# EAGLE design main (EAGLE 8.3.1)
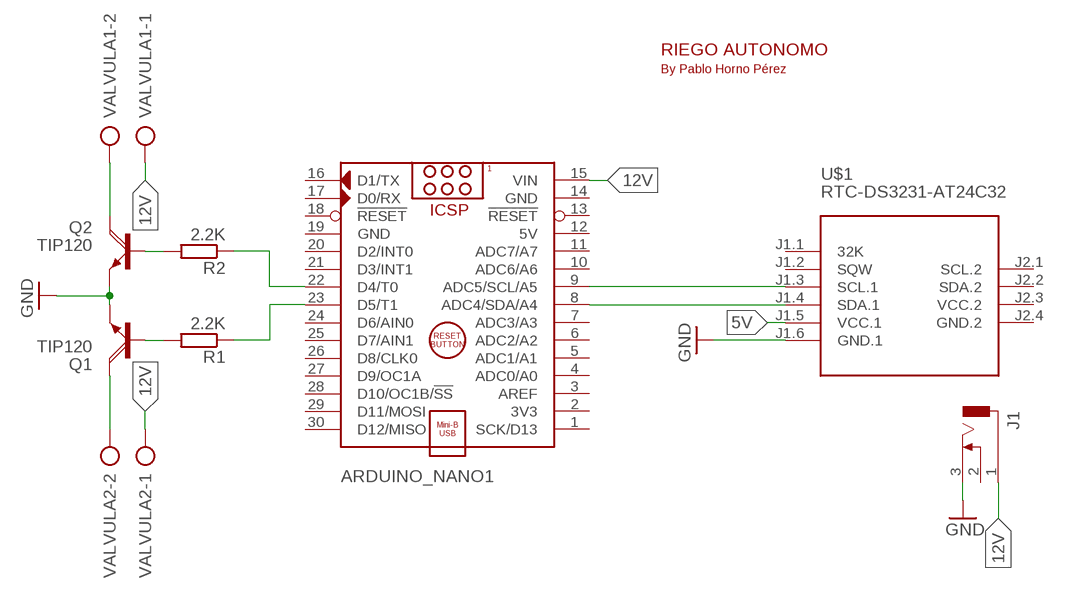
[diagram p0: schematic, sheet 1]

## Parts
ARDUINO_NANO1  ARDUINO_NANO  [ARDUINO_NANO]
J1  DCJ0303  [DCJ0303]
Q1  TIP120  [TO220AH]
Q2  TIP120  [TO220AH]
R1  2.2K  R-EU_0207/10  [0207/10]
R2  2.2K  R-EU_0207/10  [0207/10]
U$1  RTC-DS3231-AT24C32  [RTC-DS3231-AT24C32]
VALVULA1  AK500/2  [AK500/2]
VALVULA2  AK500/2  [AK500/2]

## Nets
5V: U$1.J1.5(VCC.1)
12V: ARDUINO_NANO1.15(VIN) J1.1 VALVULA1.1 VALVULA2.1
GND: J1.3 Q1.E Q2.E U$1.J1.6(GND.1)
N$1: Q2.B R2.2
N$2: Q1.B R1.2
N$3: ARDUINO_NANO1.8(ADC4/SDA/A4) U$1.J1.4(SDA.1)
N$4: ARDUINO_NANO1.9(ADC5/SCL/A5) U$1.J1.3(SCL.1)
N$5: Q1.C VALVULA2.2
N$6: Q2.C VALVULA1.2
N$7: ARDUINO_NANO1.23(D5/T1) R1.1
N$8: ARDUINO_NANO1.22(D4/T0) R2.1
Unconnected: ARDUINO_NANO1.1(SCK/D13) ARDUINO_NANO1.2(3V3) ARDUINO_NANO1.3(AREF) ARDUINO_NANO1.4(ADC0/A0) ARDUINO_NANO1.5(ADC1/A1) ARDUINO_NANO1.6(ADC2/A2) ARDUINO_NANO1.7(ADC3/A3) ARDUINO_NANO1.10(ADC6/A6) ARDUINO_NANO1.11(ADC7/A7) ARDUINO_NANO1.13(!RESET) ARDUINO_NANO1.16(D1/TX) ARDUINO_NANO1.17(D0/RX) ARDUINO_NANO1.18(!RESET) ARDUINO_NANO1.20(D2/INT0) ARDUINO_NANO1.21(D3/INT1) ARDUINO_NANO1.24(D6/AIN0) ARDUINO_NANO1.25(D7/AIN1) ARDUINO_NANO1.26(D8/CLK0) ARDUINO_NANO1.27(D9/OC1A) ARDUINO_NANO1.28(D10/OC1B/!SS) ARDUINO_NANO1.29(D11/MOSI) ARDUINO_NANO1.30(D12/MISO) J1.2 U$1.J1.1(32K) U$1.J1.2(SQW) U$1.J2.1(SCL.2) U$1.J2.2(SDA.2)

## Notes on the sheet
- RIEGO AUTONOMO
- By Pablo Horno Pérez

## Power pins joined to a net without a drawn wire
5V: ARDUINO_NANO1.12(5V)
GND: ARDUINO_NANO1.14(GND) ARDUINO_NANO1.19(GND)
GND.2: U$1.J2.4(GND.2)
VCC.2: U$1.J2.3(VCC.2)

## Library data of the parts
ARDUINO_NANO1 = ArduinoNanoV30:ARDUINO_NANO: Arduino Nano V3.0 Module Overview: The Arduino Nano is a small, complete, and breadboard-friendly board based on the ATmega328 (Arduino Nano 3.x) or ATmega168 (Arduino Nano 2.x). It has more or less the same functionality of the Arduino Duemilanove, but in a different package. It lacks only a DC power jack, and works with a Mini-B USB cable instead of a standard one. The Nano was designed and is being produced by Gravitech <http://www.gravitech.us/arna30wiatp.html>. General specifications: Item Value Microcontroller Atmel ATmega168 or ATmega328 Operating Voltage (logic level) 5 V Input Voltage (recommended) 7-12 V Input Voltage (limits) 6-20 V Digital I/O Pins 14 (of which 6 provide PWM output) Analog Input Pins 8 DC Current per I/O Pin 40 mA Flash Memory 16 KB (ATmega168) or 32 KB (ATmega328) of which 2 KB used by bootloader SRAM 1 KB (ATmega168) or 2 KB (ATmega328) EEPROM 512 bytes (ATmega168) or 1 KB (ATmega328) Clock Speed 16 MHz Dimensions (Inches) 0.73" x 1.70" Dimensions (mm) 18mm x 45mm Overall height About 9 mm (not including pins) Weigth 5 g Power: The Arduino Nano can be powered via the Mini-B USB connection, 6-20V unregulated external power supply (pin 30), or 5V regulated external power supply (pin 27). The power source is automatically selected to the highest voltage source. Memory: The ATmega168 has 16 KB of flash memory for storing code (of which 2 KB is used for the bootloader); the ATmega328 has 32 KB, (also with 2 KB used for the bootloader). The ATmega168 has 1 KB of SRAM and 512 bytes of EEPROM (which can be read and written with the EEPROM library); the ATmega328 has 2 KB of SRAM and 1 KB of EEPROM. Input and Output: Each of the 14 digital pins on the Nano can be used as an input or output, using pinMode(), digitalWrite(), and digitalRead() functions. They operate at 5 volts. Each pin can provide or receive a maximum of 40 mA and has an internal pull-up resistor (disconnected by default) of 20-50 kOhms. In addition, some pins have specialized functions. Visit Arduino - ArduinoBoardNano <https://www.arduino.cc/en/Main/ArduinoBoardNano>
J1 = con-jack:DCJ0303: DC POWER JACK Source: DCJ0303.pdf; OC_FARNELL: unknown; OC_NEWARK: unknown
Q1 Q2 = transistor-power:TIP120: NPN DARLINGTON TRANSISTOR
R1 R2 = resistor:R-EU_: RESISTOR, European symbol
U$1 = diy-modules:RTC-DS3231-AT24C32: RTC Module with Battery and EEPROM based on DS3231 and AT24C32 chips Tutorial can be found here: https://edwardmallon.wordpress.com/2014/05/21/using-a-cheap-3-ds3231-rtc-at24c32-eeprom-from-ebay/ Click here to find device on ebay.com <http://www.ebay.com/sch/DS3231+AT24C32+module>
VALVULA1 VALVULA2 = con-ptr500:AK500/2: CONNECTOR; OC_FARNELL: unknown; OC_NEWARK: unknown

## Net classes
0 default: width 1.016 mm, clearance 0.508 mm

## Board
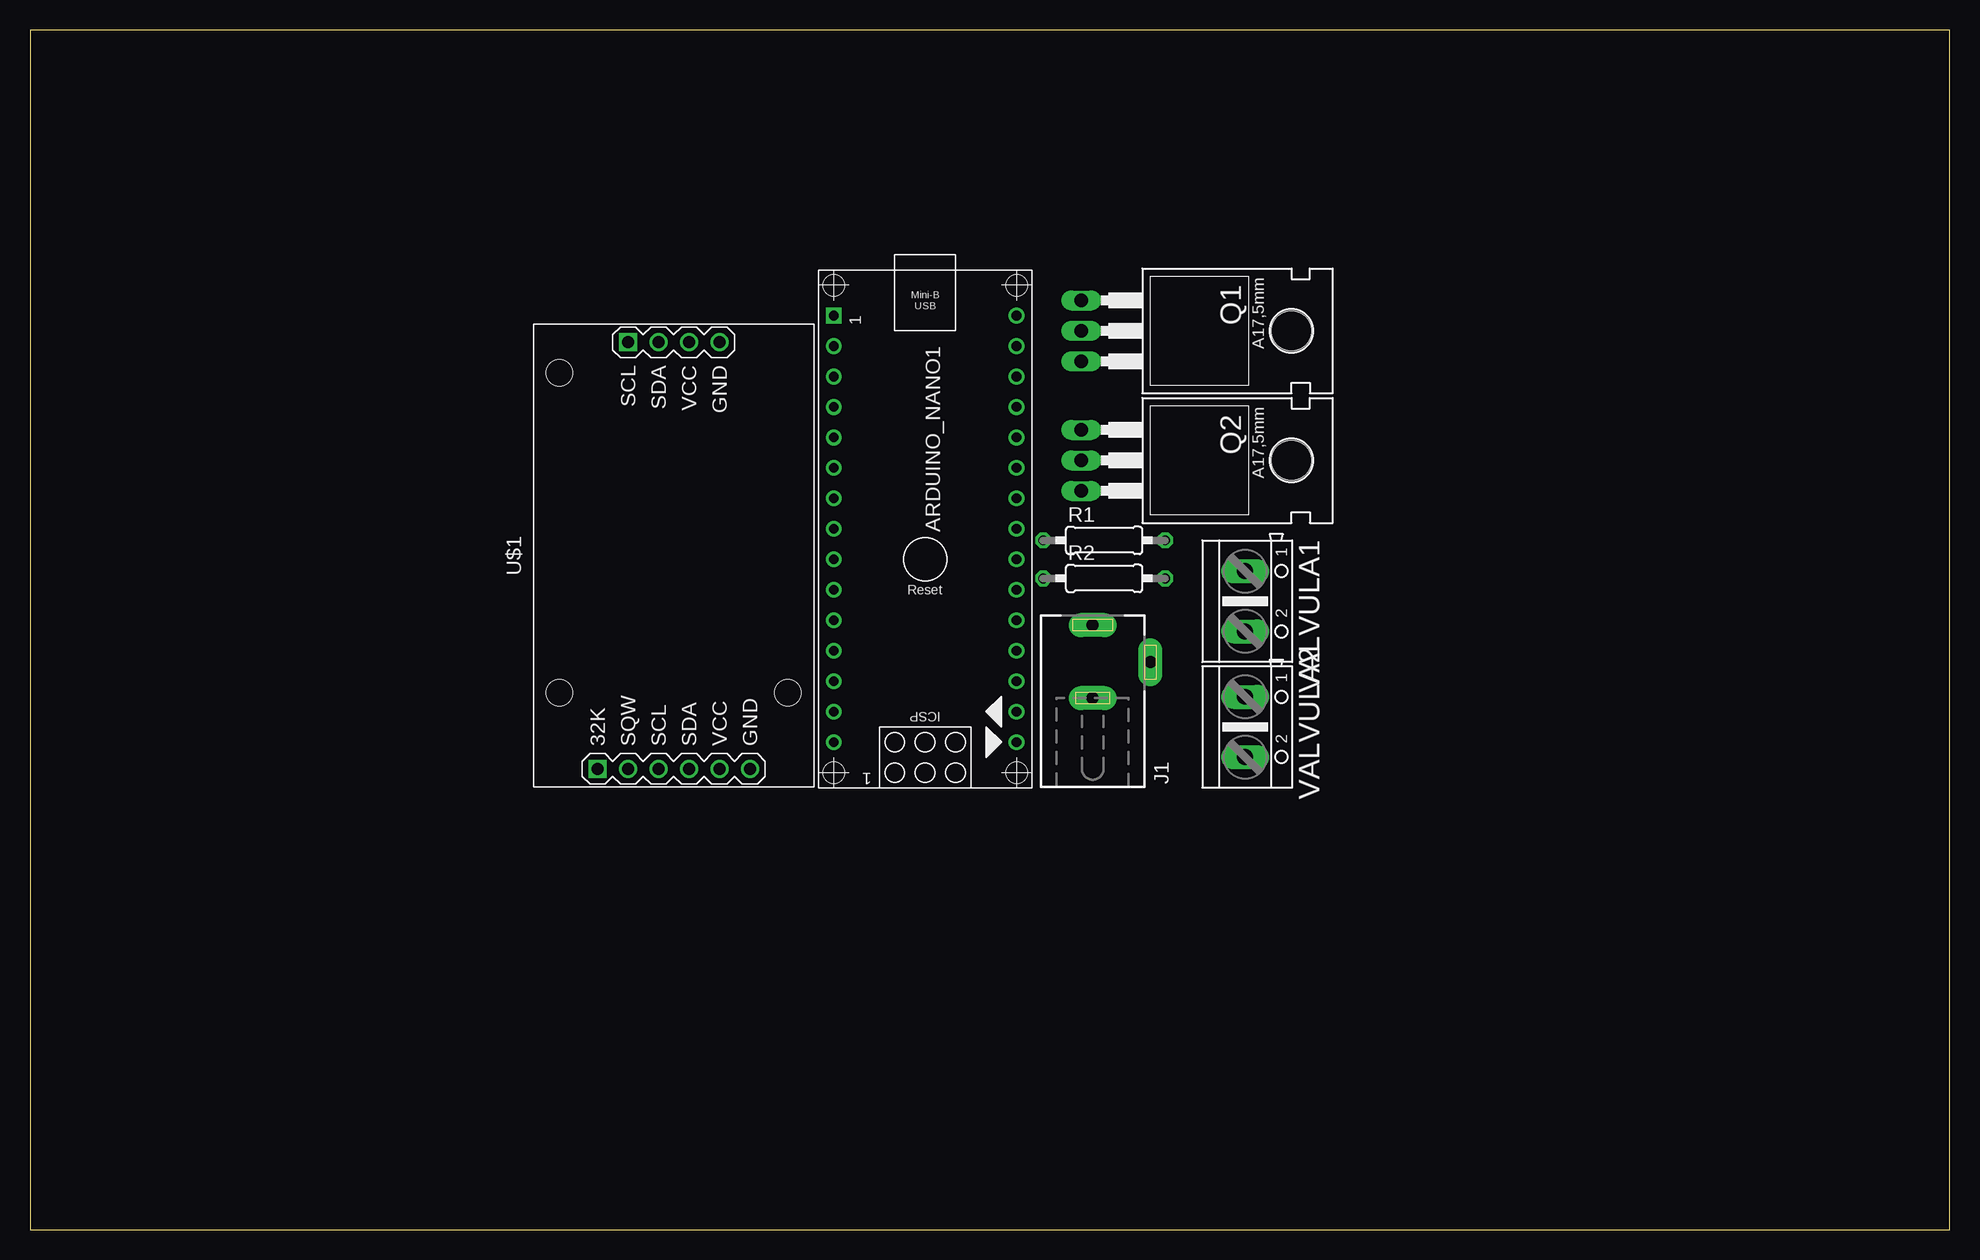
[diagram p1: board, top side]
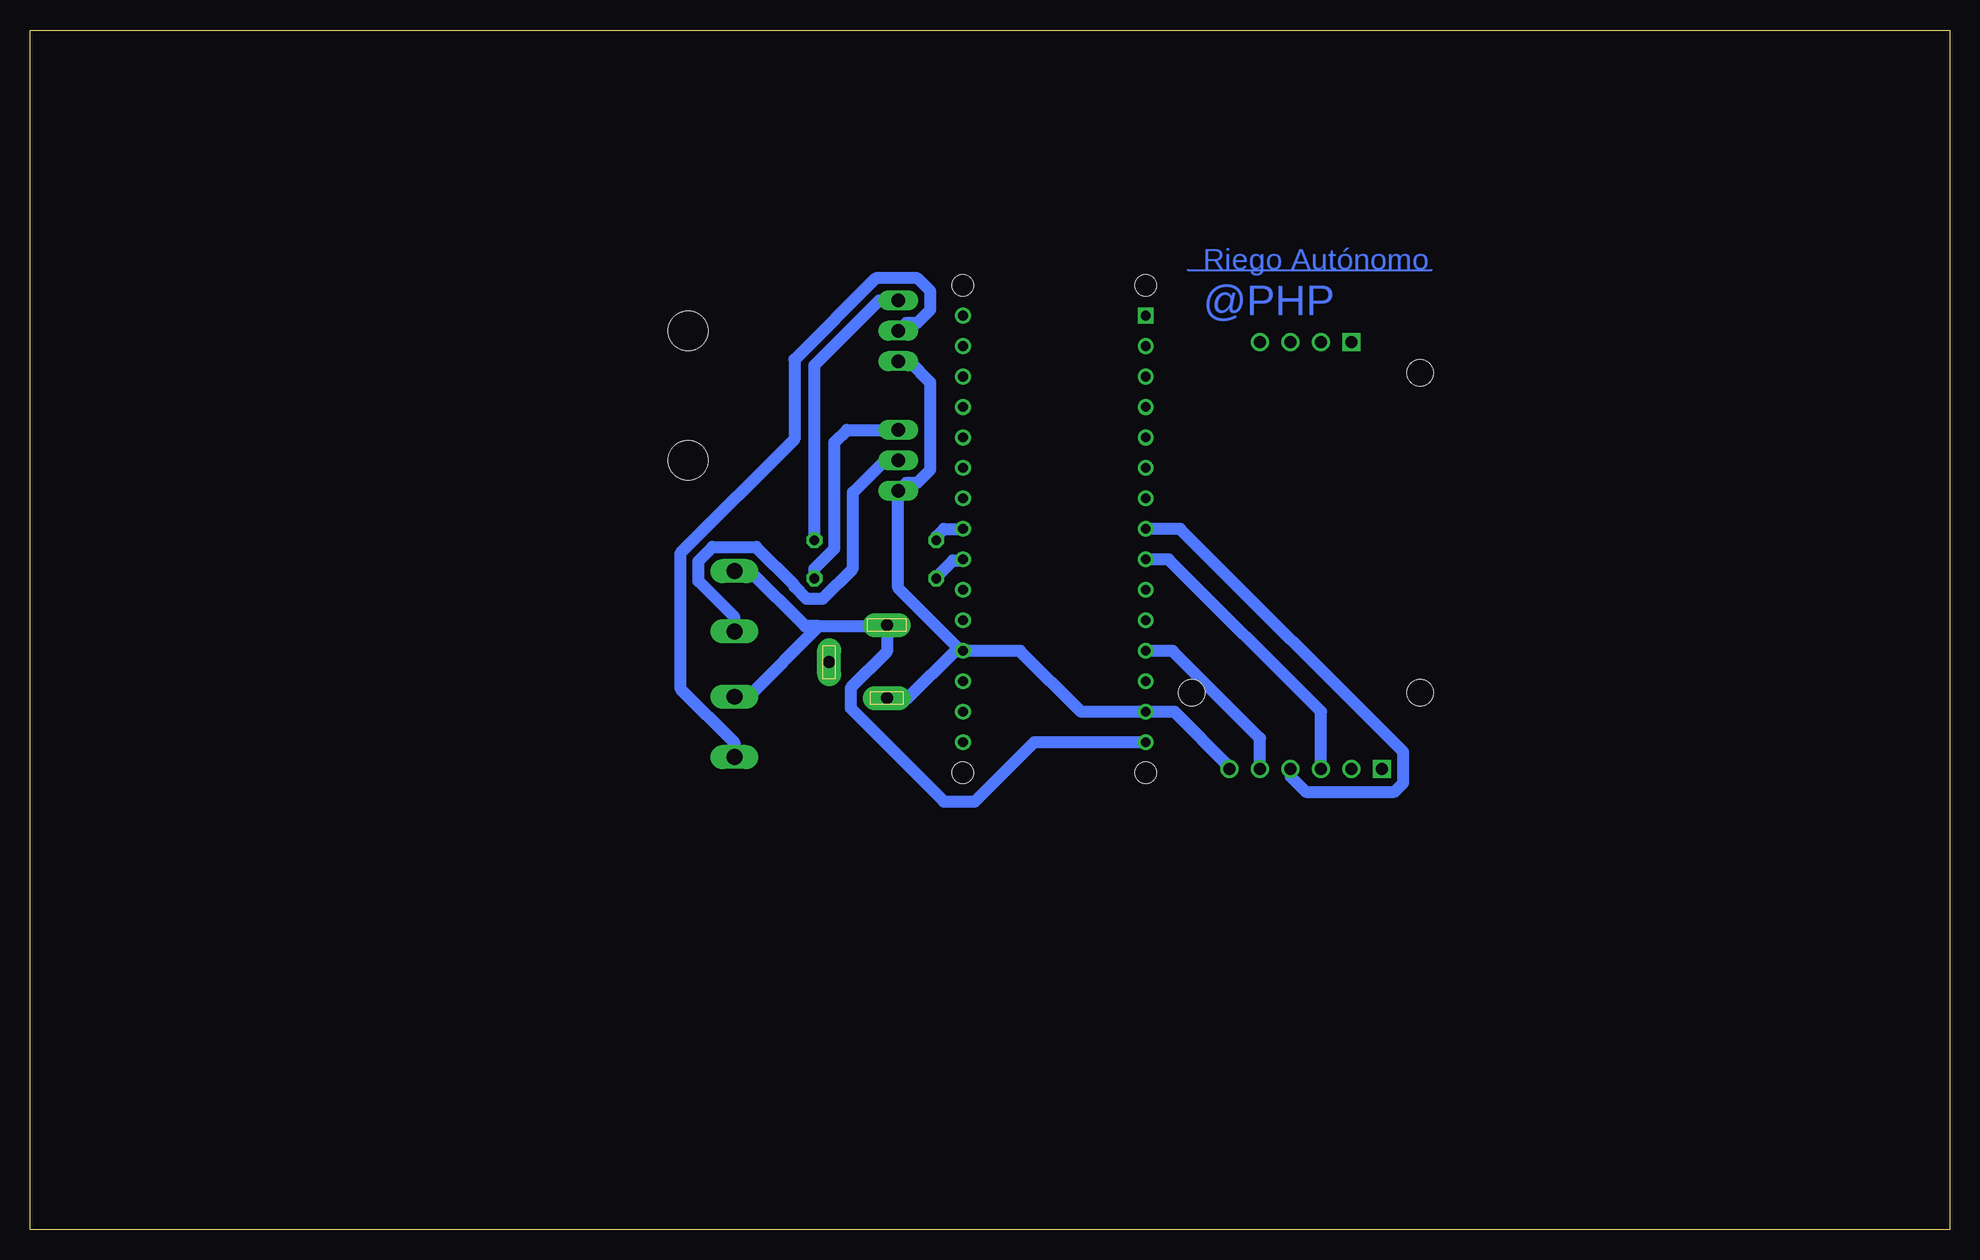
[diagram p2: board, bottom side, seen from below]

Size 160 x 100.01 mm. Coordinates in mm from the lower left corner, seen from the top.
Outline: 0,100 160,100 160,0 0,0 0,100
Outline: 0,100.01 0,100
Copper layers (1*16): Top 0.035mm / dielectric 1.5mm / Bottom 0.035mm
Design rules "default": minimum track width 6mil, minimum drill 0.35mm, track to track 6mil, track to pad 6mil, pad to pad 6mil, via to via 6mil, smd to smd 6mil, copper to edge 40mil, drill to drill 6mil, minimum pad ring 10mil, minimum via ring 8mil, stop-mask expansion 4mil, vias tented up to drill 0mil, thermal gap 10mil

### Footprints (pad centres in the part's own frame; a part is rotated, then mirrored left to right if it is on the bottom)
ARDUINO_NANO = drill 0.8 square: 1 -20.32,-7.62 | drill 0.8: 2 -17.78,-7.62; 3 -15.24,-7.62; 4 -12.7,-7.62; 5 -10.16,-7.62; 6 -7.62,-7.62; 7 -5.08,-7.62; 8 -2.54,-7.62; 9 0,-7.62; 10 2.54,-7.62; 11 5.08,-7.62; 12 7.62,-7.62; 13 10.16,-7.62; 14 12.7,-7.62; 15 15.24,-7.62; 16 15.24,7.62; 17 12.7,7.62; 18 10.16,7.62; 19 7.62,7.62; 20 5.08,7.62; 21 2.54,7.62; 22 0,7.62; 23 -2.54,7.62; 24 -5.08,7.62; 25 -7.62,7.62; 26 -10.16,7.62; 27 -12.7,7.62; 28 -15.24,7.62; 29 -17.78,7.62; 30 -20.32,7.62 | hole 1.778: -22.86,-7.62; -22.86,7.62; 17.78,7.62; 17.78,-7.62
DCJ0303 = drill 1 pad 2 long: 1 0,3.1; 2 4.8,0; 3 0,-3
TO220AH = drill 1.118 long: B -2.54,-6.35; C 0,-6.35; E 2.54,-6.35 | hole 3.302: 0,11.176
0207/10 = drill 0.813 octagon: 1 -5.08,0; 2 5.08,0
RTC-DS3231-AT24C32 = drill 1 square: J1.1 -17.78,6.35; J2.1 17.78,3.81 | drill 1: J1.2 -17.78,3.81; J1.3 -17.78,1.27; J1.4 -17.78,-1.27; J1.5 -17.78,-3.81; J1.6 -17.78,-6.35; J2.2 17.78,1.27; J2.3 17.78,-1.27; J2.4 17.78,-3.81 | hole 2.2: -11.43,-9.525; -11.43,9.525; 15.24,9.525
AK500/2 = drill 1.321 long: 1 -2.515,0; 2 2.515,0

### Placement (x,y rotation side)
ARDUINO_NANO1  74.61,55.88 270 top
J1  88.58,47.31 0 top
Q1  93.98,74.93 270 top
Q2  93.98,64.14 270 top
R1  89.53,57.47 0 top
R2  89.53,54.29 0 top
U$1  53.66,56.2 90 top
VALVULA1  101.28,52.39 270 top
VALVULA2  101.28,41.91 270 top

### Tracks (layer width: path | path; a pad name or v marks a point on that pad's centre or on a via)
5V
  Bottom 1.016: ARDUINO_NANO1.12 64.77,48.26 57.47,40.96 U$1.J1.5
12V
  Bottom 1.016: VALVULA2.1 100.12,44.42 94.22,50.32 | 94.22,50.32 88.67,50.32 J1.1 88.58,48.16 91.6,45.14 91.6,43.47 83.81,35.69 81.23,35.69 76.28,40.64 ARDUINO_NANO1.15 | 94.22,50.32 95.41,50.32 100.01,54.93 101.26,54.93 VALVULA1.1
GND
  Bottom 1.016: ARDUINO_NANO1.19 77.47,48.26 72.39,43.18 ARDUINO_NANO1.14 64.59,43.18 60.01,38.59 U$1.J1.6 | ARDUINO_NANO1.19 82.87,48.26 86.84,44.29 88.57,44.29 J1.3 | ARDUINO_NANO1.19 82.39,48.26 87.63,53.5 Q2.E 86.94,62.28 86.02,62.28 84.94,63.37 84.94,70.63 86.7,72.39 Q1.E
N$1
  Bottom 1.016: R2.2 94.61,55.1 92.94,56.77 92.94,65.65 91.92,66.67 Q2.B
N$2
  Bottom 1.016: R1.2 94.61,72.07 89.22,77.47 Q1.B
N$3
  Bottom 1.016: U$1.J1.4 54.93,37.78 53.66,36.51 46.27,36.51 45.54,37.24 45.54,39.82 64.14,58.42 ARDUINO_NANO1.8
N$4
  Bottom 1.016: U$1.J1.3 52.39,43.18 65.09,55.88 ARDUINO_NANO1.9
N$5
  Bottom 1.016: Q1.C 86.94,75.62 86.02,75.62 84.94,76.7 84.94,78.24 86.02,79.32 89.52,79.32 96.29,72.55 96.29,65.88 105.8,56.37 105.8,45.12 101.28,40.6 VALVULA2.2
N$6
  Bottom 1.016: VALVULA1.2 101.28,51.07 104.28,54.07 104.28,55.73 103.1,56.91 99.46,56.91 96.29,53.74 96.29,53.6 95.31,52.62 93.92,52.62 91.42,55.12 91.42,61.46 88.74,64.14 Q2.C
N$7
  Bottom 1.016: R1.1 84.45,57.78 83.82,58.42 ARDUINO_NANO1.23
N$8
  Bottom 1.016: ARDUINO_NANO1.22 82.32,55.79 83.07,55.79 84.45,54.41 R2.1
N$9
  Bottom 0.152: 63.5,80.01 43.18,80.01

### Text on the board
Bottom: Riego Autónomo | @PHP